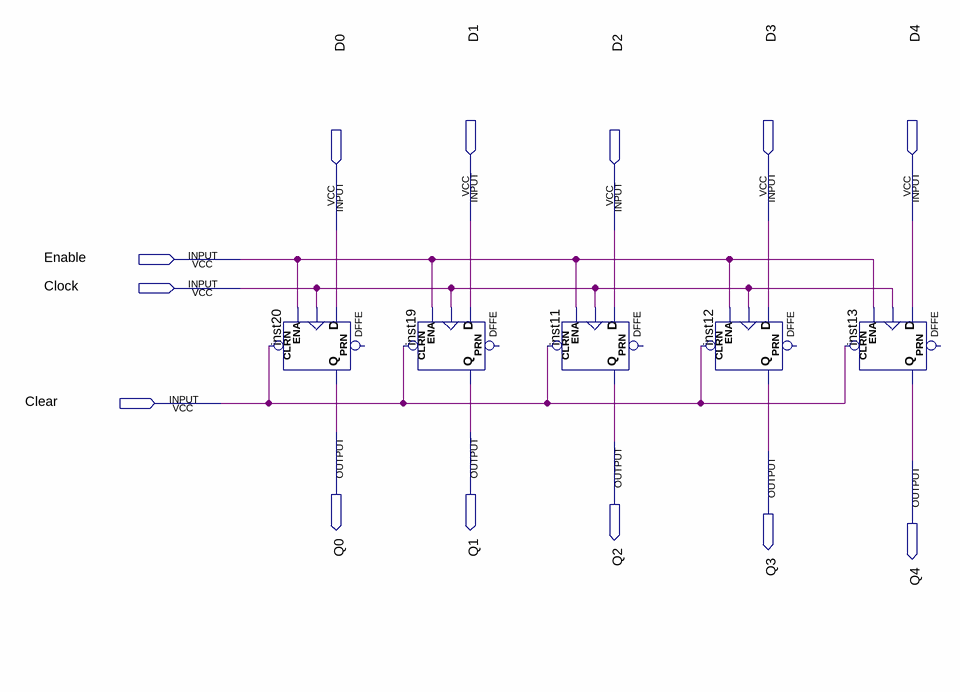
[diagram p0: schematic sheet]
// Quartus schematic register5Bit.bdf as structural Verilog: 5 symbols, 13 pins
module register5Bit (
  input  D1,
  input  D3,
  input  D4,
  input  D0,
  input  D2,
  input  Enable,
  input  Clock,
  input  Clear,
  output Q0,
  output Q1,
  output Q2,
  output Q3,
  output Q4
);

  DFFE inst20 (.CLRN(Clear), .D(D0), .CLK(Clock), .ENA(Enable), .Q(Q0));  // open: PRN
  DFFE inst19 (.CLRN(Clear), .D(D1), .CLK(Clock), .ENA(Enable), .Q(Q1));  // open: PRN
  DFFE inst11 (.CLRN(Clear), .D(D2), .CLK(Clock), .ENA(Enable), .Q(Q2));  // open: PRN
  DFFE inst12 (.CLRN(Clear), .D(D3), .CLK(Clock), .ENA(Enable), .Q(Q3));  // open: PRN
  DFFE inst13 (.CLRN(Clear), .D(D4), .CLK(Clock), .ENA(Enable), .Q(Q4));  // open: PRN
endmodule
